# Altium schematic sheet MCU.SchDoc
size A4
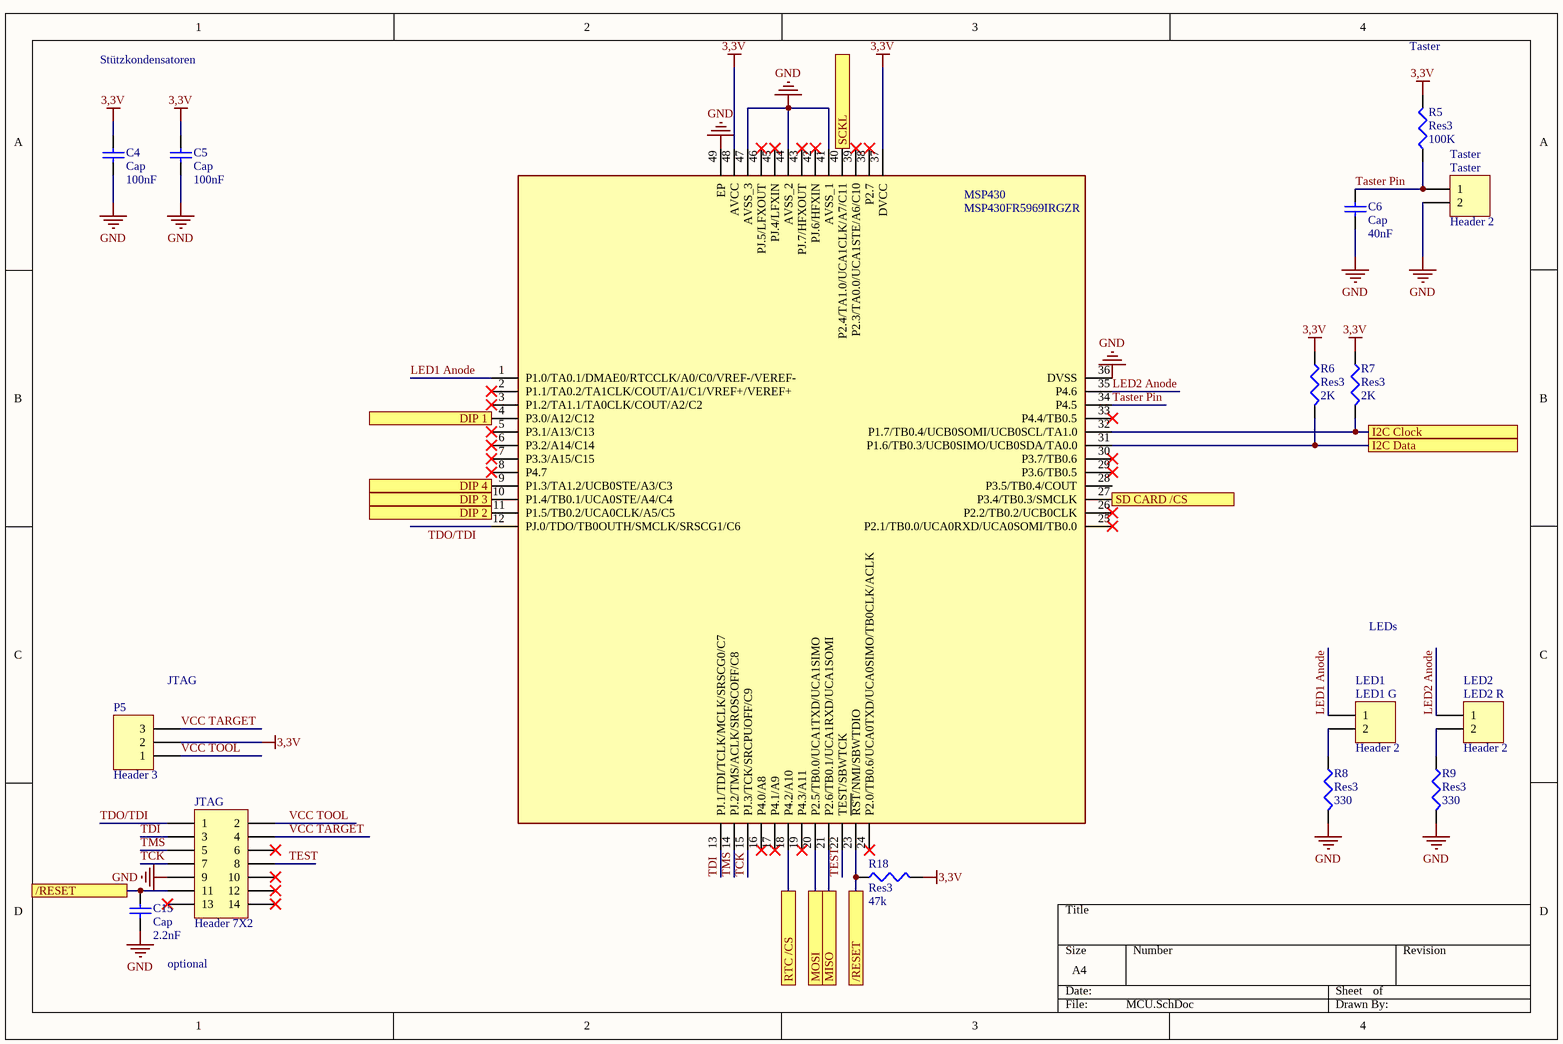
[diagram p0: MCU.SchDoc]

## Parts
C4  Cap  value 100nF  [1608[0603]]
C5  Cap  value 100nF  [1608[0603]]
C6  Cap  value 40nF  [1608[0603]]
C15  Cap  value 2.2nF  [1608[0603]]
JTAG  Header 7X2  [HDR2X7]
LED1_G  Header 2  [HDR1X2]
LED2_R  Header 2  [HDR1X2]
MSP430  MSP430FR5969IRGZR  [QFN50P700X700X100-49N-D]
P5  Header 3  [HDR1X3]
R5  Res3  value 100K  [J1-0603]
R6  Res3  value 2K  [J1-0603]
R7  Res3  value 2K  [J1-0603]
R8  Res3  value 330  [J1-0603]
R9  Res3  value 330  [J1-0603]
R18  Res3  value 47k  [J1-0603]
Taster  Header 2  [HDR1X2]

## Ports
/RESET, DIP 1, DIP 2, DIP 3, DIP 4, I2C Clock, I2C Data, MISO, MOSI, RTC /CS, SCKL, SD CARD /CS

## Nets
3,3V: C4.2 C5.2 MSP430.37(DVCC) MSP430.48(AVCC) P5.2 R5.2 R6.1 R7.1 R18.2
GND: C4.1 C5.1 C6.1 C15.1 JTAG.9 MSP430.36(DVSS) MSP430.41(AVSS_1) MSP430.44(AVSS_2) MSP430.47(AVSS_3) MSP430.49(EP) R8.2 R9.2 Taster.2
/RESET: C15.2 JTAG.11 MSP430.23(~{RST}/NMI/SBWTDIO) R18.1 ; port /RESET
DIP 1: MSP430.4(P3.0/A12/C12) ; port DIP 1
DIP 2: MSP430.11(P1.5/TB0.2/UCA0CLK/A5/C5) ; port DIP 2
DIP 3: MSP430.10(P1.4/TB0.1/UCA0STE/A4/C4) ; port DIP 3
DIP 4: MSP430.9(P1.3/TA1.2/UCB0STE/A3/C3) ; port DIP 4
I2C Clock: MSP430.32(P1.7/TB0.4/UCB0SOMI/UCB0SCL/TA1.0) R7.2 ; port I2C Clock
I2C Data: MSP430.31(P1.6/TB0.3/UCB0SIMO/UCB0SDA/TA0.0) R6.2 ; port I2C Data
LED1 Anode: LED1_G.1 MSP430.1(P1.0/TA0.1/DMAE0/RTCCLK/A0/C0/VREF-/VEREF-)
LED2 Anode: LED2_R.1 MSP430.35(P4.6)
MISO: MSP430.21(P2.6/TB0.1/UCA1RXD/UCA1SOMI) ; port MISO
MOSI: MSP430.20(P2.5/TB0.0/UCA1TXD/UCA1SIMO) ; port MOSI
RTC /CS: MSP430.18(P4.2/A10) ; port RTC /CS
SCKL: MSP430.40(P2.4/TA1.0/UCA1CLK/A7/C11) ; port SCKL
SD CARD /CS: MSP430.27(P3.4/TB0.3/SMCLK) ; port SD CARD /CS
Taster Pin: C6.2 MSP430.34(P4.5) R5.1 Taster.1
TCK: JTAG.7 MSP430.15(PJ.3/TCK/SRCPUOFF/C9)
TDI: JTAG.3 MSP430.13(PJ.1/TDI/TCLK/MCLK/SRSCG0/C7)
TDO/TDI: JTAG.1 MSP430.12(PJ.0/TDO/TB0OUTH/SMCLK/SRSCG1/C6)
TEST: JTAG.8 MSP430.22(TEST/SBWTCK)
TMS: JTAG.5 MSP430.14(PJ.2/TMS/ACLK/SROSCOFF/C8)
VCC TARGET: JTAG.4 P5.3
VCC TOOL: JTAG.2 P5.1
NetLED1_G_2: LED1_G.2 R8.1
NetLED2_R_2: LED2_R.2 R9.1

Not connected (* = marked no-connect by the designer): JTAG 6* 10* 12* 13* 14*; MSP430 2(P1.1/TA0.2/TA1CLK/COUT/A1/C1/VREF+/VEREF+)* 3(P1.2/TA1.1/TA0CLK/COUT/A2/C2)* 5(P3.1/A13/C13)* 6(P3.2/A14/C14)* 7(P3.3/A15/C15)* 8(P4.7)* 16(P4.0/A8)* 17(P4.1/A9)* 19(P4.3/A11)* 24(P2.0/TB0.6/UCA0TXD/UCA0SIMO/TB0CLK/ACLK)* 25(P2.1/TB0.0/UCA0RXD/UCA0SOMI/TB0.0)* 26(P2.2/TB0.2/UCB0CLK)* 28(P3.5/TB0.4/COUT) 29(P3.6/TB0.5)* 30(P3.7/TB0.6)* 33(P4.4/TB0.5)* 38(P2.7)* 39(P2.3/TA0.0/UCA1STE/A6/C10)* 42(PJ.6/HFXIN)* 43(PJ.7/HFXOUT)* 45(PJ.4/LFXIN)* 46(PJ.5/LFXOUT)*

## Notes on the sheet
- Taster
- Stützkondensatoren
- LEDs
- (near P5) JTAG
- (near LED1_G) LED1
- (near LED2_R) LED2
- optional

## Library data of the parts
C4-C6 C15 = Cap: Capacitor; Published: 8-Jun-2000; LatestRevisionDate: 17-Jul-2002; LatestRevisionNote: Re-released for DXP Platform.; PackageReference: RAD-0.3; Publisher: Altium Limited; PackageDescription: Radial Cap, Thru-Hole; 2 Leads; 0.3 in Pin Spacing
JTAG = Header 7X2: Header, 7-Pin, Dual row; LatestRevisionDate: 17-Jul-2002; LatestRevisionNote: Re-released for DXP Platform.; Publisher: Altium Limited
LED1_G LED2_R Taster = Header 2: Header, 2-Pin; LatestRevisionDate: 17-Jul-2002; LatestRevisionNote: Re-released for DXP Platform.; Publisher: Altium Limited
MSP430 = MSP430FR5969IRGZR: Integrated Circuit; Manufacturer_Name: Texas Instruments; Datasheet Link: http://www.ti.com/lit/gpn/msp430fr5969; Height: 1mm; Manufacturer_Part_Number: MSP430FR5969IRGZR
P5 = Header 3: Header, 3-Pin; LatestRevisionDate: 17-Jul-2002; LatestRevisionNote: Re-released for DXP Platform.; Publisher: Altium Limited
R5-R9 R18 = Res3: Resistor; Published: 8-Jun-2000; LatestRevisionDate: 29-May-2009; LatestRevisionNote: IPC-7351 Footprint Added.; PackageReference: J1-0603; Publisher: Altium Limited; PackageDescription: Chip Resistor